# Altium schematic sheet SCA-Digital.SchDoc: SCA IO
size A; DocumentNumber: 20; SheetNumber: 20; SheetTotal: 22
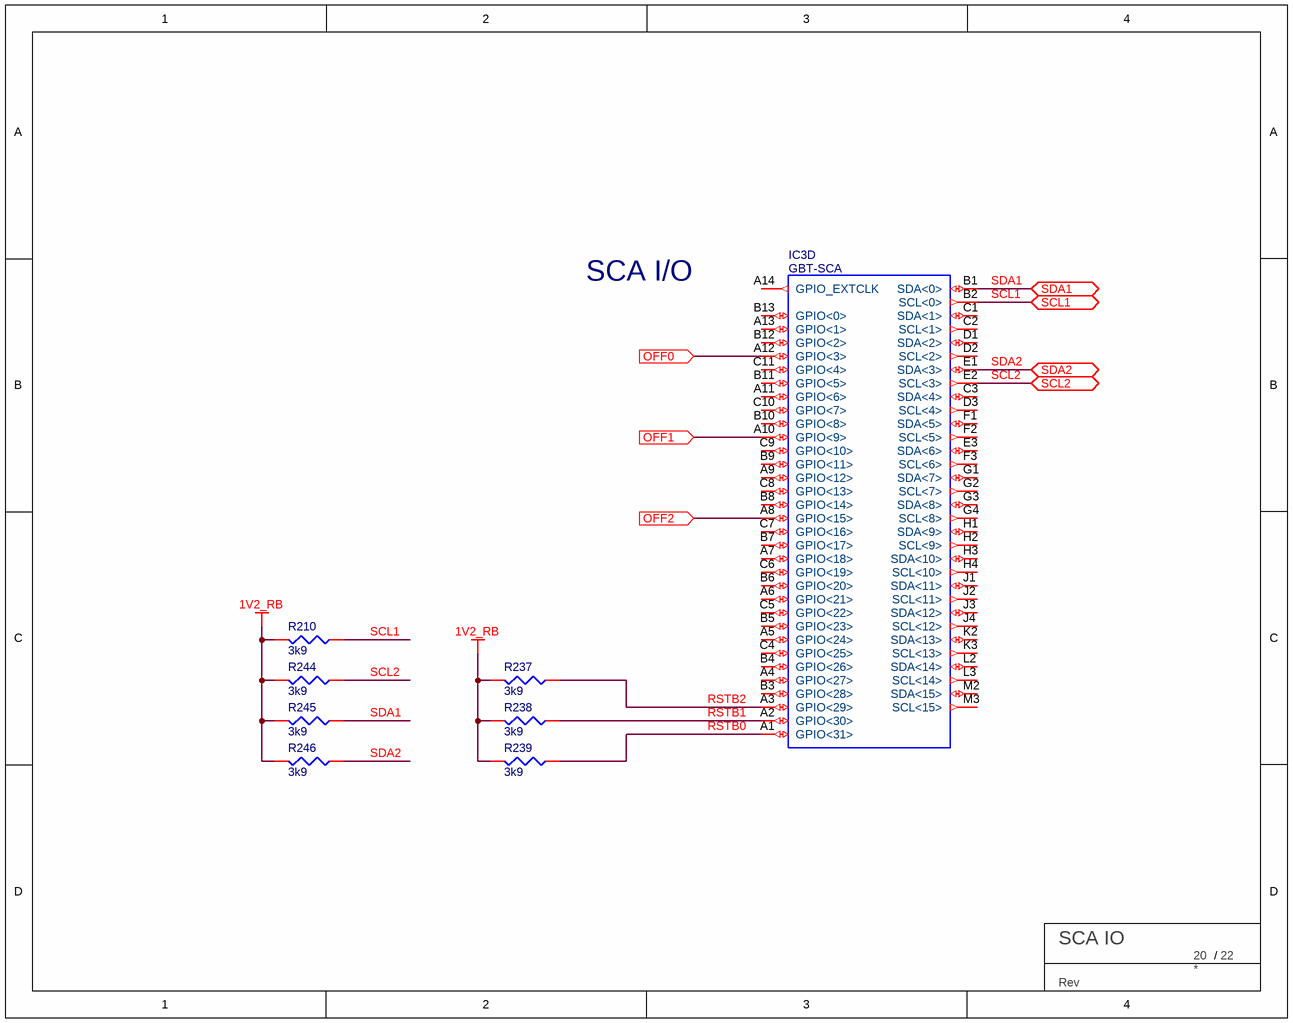
[diagram p0: SCA-Digital.SchDoc]

## Parts
IC3  GBT-SCA  [BGA196C80P14X14_1200X1200X170]  (part D of 6)
R210  3k9  [R_0402_IPC]
R237  3k9  [R_0402_IPC]
R238  3k9  [R_0402_IPC]
R239  3k9  [R_0402_IPC]
R244  3k9  [R_0402_IPC]
R245  3k9  [R_0402_IPC]
R246  3k9  [R_0402_IPC]
TBLOCK?  BU Title block  (value not drawn)  (graphical)

## Ports
OFF0 (in), OFF1 (in), OFF2 (in), SCL1 (bidir), SCL2 (bidir), SDA1 (bidir), SDA2 (bidir)

## Nets
1V2_RB: R210.2 R237.2 R238.2 R239.2 R244.2 R245.2 R246.2
OFF0: IC3.A12(GPIO<3>) ; port OFF0
OFF1: IC3.A10(GPIO<9>) ; port OFF1
OFF2: IC3.A8(GPIO<15>) ; port OFF2
RSTB0: IC3.A1(GPIO<31>) R239.1
RSTB1: IC3.A2(GPIO<30>) R238.1
RSTB2: IC3.A3(GPIO<29>) R237.1
SCL1: IC3.B2(SCL<0>) R210.1 ; port SCL1
SCL2: IC3.E2(SCL<3>) R244.1 ; port SCL2
SDA1: IC3.B1(SDA<0>) R245.1 ; port SDA1
SDA2: IC3.E1(SDA<3>) R246.1 ; port SDA2

Not connected (* = marked no-connect by the designer): IC3 A4(GPIO<27>) A5(GPIO<24>) A6(GPIO<21>) A7(GPIO<18>) A9(GPIO<12>) A11(GPIO<6>) A13(GPIO<1>) A14(GPIO_EXTCLK) B3(GPIO<28>) B4(GPIO<26>) B5(GPIO<23>) B6(GPIO<20>) B7(GPIO<17>) B8(GPIO<14>) B9(GPIO<11>) B10(GPIO<8>) B11(GPIO<5>) B12(GPIO<2>) B13(GPIO<0>) C1(SDA<1>) C2(SCL<1>) C3(SDA<4>) C4(GPIO<25>) C5(GPIO<22>) C6(GPIO<19>) C7(GPIO<16>) C8(GPIO<13>) C9(GPIO<10>) C10(GPIO<7>) C11(GPIO<4>) D1(SDA<2>) D2(SCL<2>) D3(SCL<4>) E3(SDA<6>) F1(SDA<5>) F2(SCL<5>) F3(SCL<6>) G1(SDA<7>) G2(SCL<7>) G3(SDA<8>) G4(SCL<8>) H1(SDA<9>) H2(SCL<9>) H3(SDA<10>) H4(SCL<10>) J1(SDA<11>) J2(SCL<11>) J3(SDA<12>) J4(SCL<12>) K2(SDA<13>) K3(SCL<13>) L2(SDA<14>) L3(SCL<14>) M2(SDA<15>) M3(SCL<15>)

## Notes on the sheet
- SCA I/O
- (in symbol TITLE_BLOCK_BU) /; Rev

## Library data of the parts
IC3 = CERN_GBT-SCA_REV 6.2: The Slow Control Adapter ASIC for the GBT System; Device: GBT-SCA
R210 R237-R239 R244-R246 = R-E3-3K9-0402-5%: RES SMD 3.9K OHM 5% 1/16W 0402
TBLOCK? = TITLE_BLOCK_BU